# Altium schematic sheet smarttrashcan.SchDoc
size A; SheetNumber: 1; SheetTotal: 1
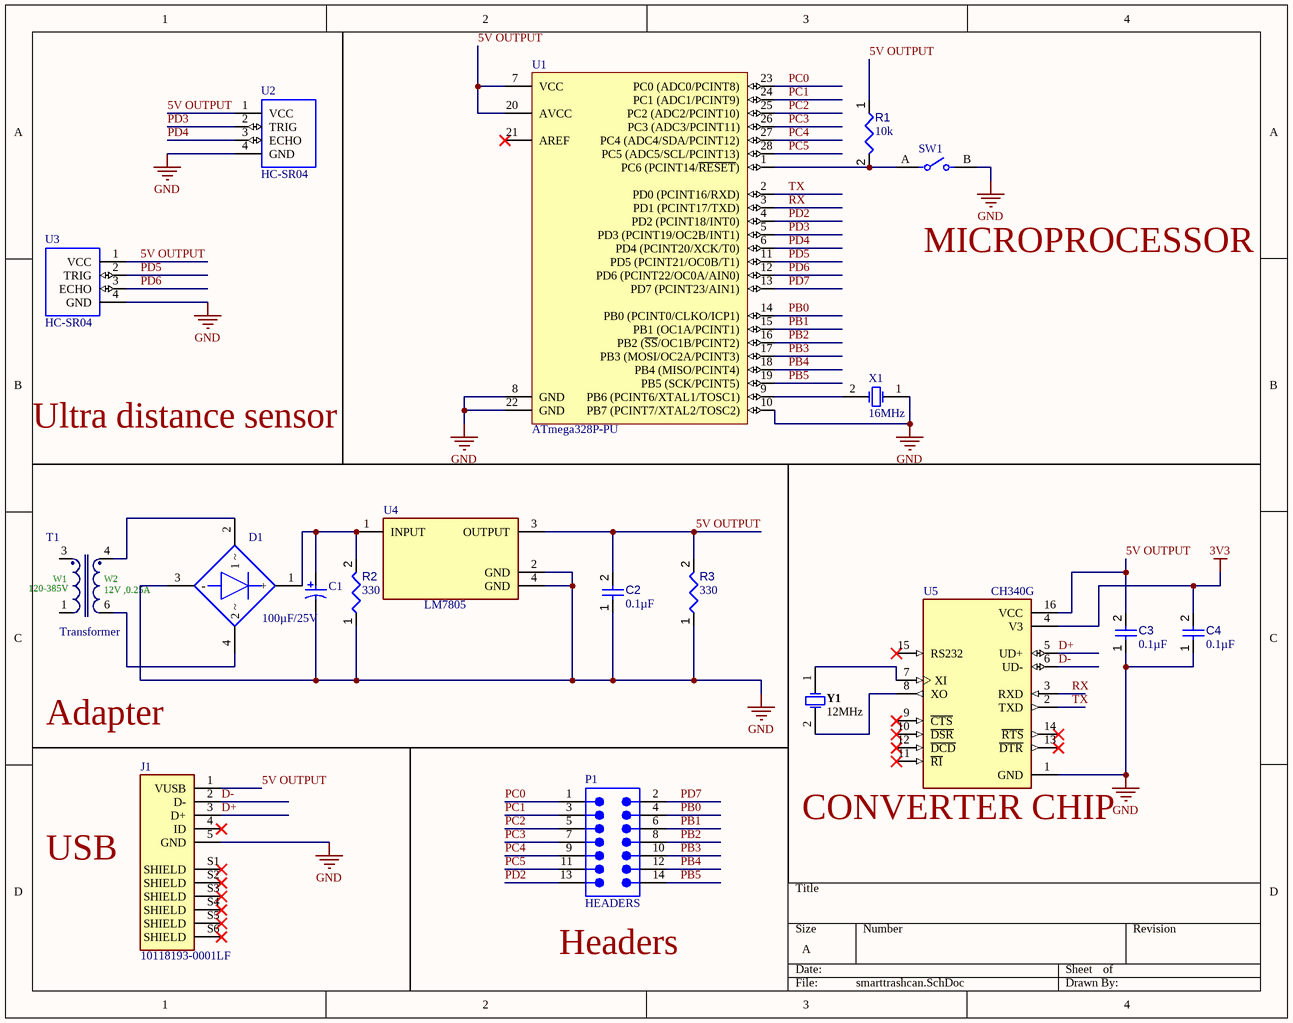
[diagram p0: smarttrashcan.SchDoc]

## Parts
C1  100µF/25V  [PNSC-FK-V-D8_V]
C2  value 0.1µF  [CAPC1005X56X25LL10T15]  (hidden comment: Capacitor 0.1 uF +/- 5% 16 V 0402)
C3  value 0.1µF  [CAPC1005X56X25LL10T15]  (hidden comment: Capacitor 0.1 uF +/- 5% 16 V 0402)
C4  value 0.1µF  [CAPC1005X56X25LL10T15]  (hidden comment: Capacitor 0.1 uF +/- 5% 16 V 0402)
D1  (no value)  [FP-MBF-MFG]
J1  10118193-0001LF  [AMPHENOL_10118193-0001LF]
P1  HEADERS  [610114249121]
R1  value 10k  [RESC0402(1005)_L]  (hidden comment: 10KR2F)
R2  value 330  [RESC0402(1005)_L]  (hidden comment: Resistor 330R +/-5 % 0402 63 mW)
R3  value 330  [RESC0402(1005)_L]  (hidden comment: Resistor 330R +/-5 % 0402 63 mW)
SW1  EVQ11Y04K  [FP-EVQ11Y04K-MFG]  (value not drawn)
T1  Transformer  [EE13_7_4-Vertical_(EF12.6)]
U1  ATmega328P-PU  [28P3]
U2  HC-SR04  [XCVR_HC-SR04]
U3  HC-SR04  [XCVR_HC-SR04]
U4  LM7805  [FP-DCY0004A-MFG]
U5  CH340G  [SOIC127P600X180-16N]
X1  16MHz  [FOX-FOXSDLF160-20_V]
Y1  12MHz  [FOX-FOXSLF-2_V]

## Nets
3V3: C4.2 U5.4(V3)
GND: C1.2 C2.1 C3.1 C4.1 D1.3(-) J1.5(GND) R2.1 R3.1 SW1.B U1.8(GND) U1.10(PB7_(PCINT7/XTAL2/TOSC2)) U1.22(GND) U2.4(GND) U3.4(GND) U4.2(GND) U4.4(GND) U5.1(GND) X1.1(X1)
5V OUTPUT: C2.2 C3.2 J1.1(VUSB) R1.1 R3.2 U1.7(VCC) U1.20(AVCC) U2.1(VCC) U3.1(VCC) U4.3(OUTPUT) U5.16(VCC)
D+: J1.3(D+) U5.5(UD+)
D-: J1.2(D-) U5.6(UD-)
PB0: P1.4 U1.14(PB0_(PCINT0/CLKO/ICP1))
PB1: P1.6 U1.15(PB1_(OC1A/PCINT1))
PB2: P1.8 U1.16(PB2_(~{SS}/OC1B/PCINT2))
PB3: P1.10 U1.17(PB3_(MOSI/OC2A/PCINT3))
PB4: P1.12 U1.18(PB4_(MISO/PCINT4))
PB5: P1.14 U1.19(PB5_(SCK/PCINT5))
PC0: P1.1 U1.23(PC0_(ADC0/PCINT8))
PC1: P1.3 U1.24(PC1_(ADC1/PCINT9))
PC2: P1.5 U1.25(PC2_(ADC2/PCINT10))
PC3: P1.7 U1.26(PC3_(ADC3/PCINT11))
PC4: P1.9 U1.27(PC4_(ADC4/SDA/PCINT12))
PC5: P1.11 U1.28(PC5_(ADC5/SCL/PCINT13))
PD2: P1.13 U1.4(PD2_(PCINT18/INT0))
PD3: U1.5(PD3_(PCINT19/OC2B/INT1)) U2.2(TRIG)
PD4: U1.6(PD4_(PCINT20/XCK/T0)) U2.3(ECHO)
PD5: U1.11(PD5_(PCINT21/OC0B/T1)) U3.2(TRIG)
PD6: U1.12(PD6_(PCINT22/OC0A/AIN0)) U3.3(ECHO)
PD7: P1.2 U1.13(PD7_(PCINT23/AIN1))
RX: U1.3(PD1_(PCINT17/TXD)) U5.3(RXD)
TX: U1.2(PD0_(PCINT16/RXD)) U5.2(TXD)
NetC1_1: C1.1 D1.1(+) R2.2 U4.1(INPUT)
NetD1_2: D1.2(1_~) T1.4
NetD1_4: D1.4(2_~) T1.6
NetR1_2: R1.2 SW1.A U1.1(PC6_(PCINT14/~{RESET}))
NetU1_9: U1.9(PB6_(PCINT6/XTAL1/TOSC1)) X1.2(X2)
NetU5_7: U5.7(XI) Y1.1
NetU5_8: U5.8(XO) Y1.2

Not connected (* = marked no-connect by the designer): J1 4(ID)* S1(SHIELD)* S2(SHIELD)* S3(SHIELD)* S4(SHIELD)* S5(SHIELD)* S6(SHIELD)*; T1 1 3; U1 21(AREF)*; U5 9(~{CTS})* 10(~{DSR})* 11(~{RI})* 12(~{DCD})* 13(~{DTR})* 14(~{RTS})* 15(RS232)*

## Notes on the sheet
- MICROPROCESSOR
- Ultra distance sensor
- Adapter
- (near U5) CONVERTER CHIP
- USB
- (near P1) Headers
- (in symbol CMP-1476-00004-1) W1; W2; 120-385V; 12V ,0.25A

## Library data of the parts
C1 = CMP-2000-06206-1: Aluminum Electrolytic Capacitor, 100 uF, +/- 20%, 25 V, 2-Pin SMD (Size Code D8), -55 to 105 degC, RoHS, Tape and Reel; Manufacturer: Panasonic; Type: Can; Lifetime@Temperature: 2000Hrs@105°C; Capacitance: 100µF; Rated Voltage: 25V; Ripple Current: 280mA; Impedance: 0.34O; Case Size/Dimension: Ø6.3x7.7mm; Operating Temp-Max: 105°C; Series: FK; Package URL: http://industrial.panasonic.com/cdbs/www-data/pdf/RDE0000/DME0000COL48.pdf; Mounting Technology: SurfaceMount; Package Description: 2-Pin Electrolytic Aluminum Capacitor, Body 6.6 x 6.6 mm; Datasheet Version: 03/2016; Datasheet URL: http://industrial.panasonic.com/cdbs/www-data/pdf/RDE0000/ABA0000C1181.pdf; Manufacturer URL: http://www.panasonic.com/; Package Reference: FK-V-D8; Operating Temp Range: -55to+105°C
C2-C4 = CMP-001-00001-6: Chip Capacitor, 0.1 uF, +/- 5%, 16 V, 0402 (1005 Metric); Capacitor Type: Ceramic; Voltage Rating: 16V; Max Operating Temperature: 125°C; Min Operating Temperature: -55°C; Case/Package: 0402; Mounting Technology: SM; Pins: 2; Tolerance: 5%; RoHS Compliant: True
D1 = CMP-12791-000022-1: BRIDGE RECT 1PHASE 1KV 800MA MBF; Manufacturer: Diodes Incorporated; Manufacturer Part Number: MB10F-13; Max Surge Forward Current: 30A; Max Repetitive Reverse Voltage: 1000V; Peak Reverse Current: 0.2uA; Description: Bridge Rectifier Single Phase Standard 1kV Surface Mount MBF; Capacitance: 8pF; Value: 8pF; Max Junction Temp: +150°C; Forward Current: 0.5A; ComponentLink2Description: Datasheet; Category: Diode; RoHS: TRUE; Package: MBF; Device Class L2: Diodes; Lead Free: Yes; Temperature Range Low: -55°C; Footprint Url: https://www.diodes.com/assets/Package-Files/MBF.pdf; Octopart: https://octopart.com/mb10f-13-diodes+inc.-82160020; Automotive: No; Device Class L3: Rectifier Diodes; Digikey Description: BRIDGE RECT 1PHASE 1KV 800MA MBF; ComponentLink2URL: https://www.diodes.com/assets/Datasheets/MB10F.pdf; Reverse Voltage: 1000V; Temperature Range High: +150°C; Temperature: -55°C to +150°C; Mouser Description: Diode Rectifier Bridge Single 1000V 0.8A 4-Pin Case MBF T/R; Height: 1.8mm; Device Class L1: Discrete Semiconductors
J1 = CMP-002-00074-1: Right Angle Surface Mount Mount Female USB Connector 100 V ac 1.8A; MF: Amphenol ICC; Source: 10118193-0001LF.SchLib; Component Type: Standard; SnapEDA_Link: https://www.snapeda.com/parts/10118193-0001LF/Amphenol+FCI/view-part/?ref=snap; MP: 10118193-0001LF; Check_prices: https://www.snapeda.com/parts/10118193-0001LF/Amphenol+FCI/view-part/?ref=eda; Design Item ID: 10118193-0001LF; Value: *; Case/Package: None; Pins: 11
P1 = CMP-1502-01150-3: NexarPartId: 52645097; Row Spacing: 2.54mm; Contact Resistance: 20mΩ; Number of Contacts: 14; Gender: Male; Current Rating: 3A; Operating Supply Voltage: 250V; Connector Type: Male Pin; Contact Mating Length: 5.9944mm; Mount: Surface Mount; Number of Rows: 2; Contact Plating: Gold; Lead Pitch: 2.54mm; Pitch: 2.54mm; REACH SVHC: Unknown; Number of Positions: 14; RoHS: Compliant; Termination: Solder; Number of Pins: 14; Packaging: Tape and Reel; Color: Black
R1 = CMP-009-00066-2: 10K 0.063W 1% 0402 (1005 Metric)  SMD; Power: 63mW; Case/Package: 0402; Mounting Technology: SMT; Pins: 2; Tolerance: 1%
R2 R3 = CMP-009-00132-3: Chip Resistor, 330 Ohms, +/-5 %, 63 mW, -55 to 155 degC, 0402; Power: 63mW; Tolerance: 5%; Pins: 2; Max Operating Temperature: 155°C; Min Operating Temperature: -55°C; Case/Package: 0402
SW1 = CMP-05618-000106-1: SWITCH TACTILE SPST-NO 0.02A 15V; Operating Force: 1.6N; Actuator Type: Standard; Actuator Length: 0.4mm; Actuator Color: Black; Mechanical Life: 1000000Cycles; Switch Function: Off-Mom; Contact Resistance: 50mR; Switch Travel: 0.25mm; Throw Configuration: SPST; Illumination Type: Non-Illuminated; Package Quantity: 1; Max Operating Temperature: 70°C; Case/Package: Radial; Radiation Hardening: No; Packaging: Tape and Reel; Termination: PC Pin; Orientation: Straight; Min Operating Temperature: -20°C; Lead Free: Lead Free; Electrical Life: 1000000Cycles; RoHS Compliant: Yes; Max Voltage Rating (DC): 15V; Mount: Through Hole; Series: EVQ11; Size: 6mm
T1 = CMP-1476-00004-1: Off-Line Transformer WE-UNIT , L=2.8mH; Manufacturer: Wuerth Elektronik; PartNumber: 7491181012; Output Voltage (DC): 12; Turns Ratio: "8.1","1"; Output Current (A): 0.25; Inductance: 2.8mH; Input Voltage (AC): 85-265; ComponentLink2URL: http://www.we-online.de/katalog/media/pdf/7491181012.pdf; ComponentLink1Description: Manufacturer URL; ComponentLink1URL: http://www.we-online.com; ComponentLink2Description: Datasheet; PackageReference: EE13_7_4-Vertical_(EF12.6)
U1 = CMP-0095-00013-2: 8-bit AVR Microcontroller, 32KB Flash, 1KB EEPROM, 2KB SRAM, 28-pin PDIP, Industrial Grade (-40°C to 85°C); RevisionNote: DatasheetVersion updated. URLs added.; PackageVersion: revB, Sep-2001; PackageDescription: 28-lead (0.300"/7.62mm Wide) Plastic Dual Inline Package (PDIP); DatasheetVersion: revD, May-2011; ComponentLink1Description: Manufacturer URL; ComponentLink1URL: http://www.atmel.com/; PackageReference: 28P3; ComponentLink2Description: ATmega48A/48PA/88A/88PA/168A/168PA/328/328P Datasheet; ComponentLink3URL: http://www.atmel.com/dyn/resources/prod_documents/8271S.pdf; ComponentLink2URL: http://www.atmel.com/dyn/resources/prod_documents/8271.pdf; ComponentLink3Description: ATmega48A/48PA/88A/88PA/168A/168PA/328/328P Summary
U2 U3 = CMP-041-000000-1: Ultrasonic Sensor Module; Package: None; Design Item ID: HC-SR04; Value: *; MP: HC-SR04; Pin Count: 4; Availability: Unavailable; Price: None; Source: HC-SR04.SchLib; Component Type: Standard
U4 = CMP-04917-000007-1: IC REG LINEAR 5V 1.5A SOT223-4; Manufacturer Part Number: LM7805MP/NOPB; Manufacturer: Texas Instruments; Max Supply Voltage: 30V; Max Junction Temp: +150°C; Number Of Outputs: 1; Standoff Height: 0.02mm; Dropout Voltage: 2V; Accuracy Percentage: 3%; Nominal Supply Current: 8mA; Output Type: Fixed; Min Supply Voltage: 7.5V; Lead Free: Yes; Device Class L1: Integrated Circuits (ICs); Package: DCY0004A; ComponentLink2Description: Datasheet; Temperature Range Low: 0°C; ComponentLink2URL: http://www.ti.com/lit/ds/symlink/lm7800.pdf; Height: 1.8mm; Temperature: 0°C to +125°C; Category: IC; Device Class L3: Voltage Regulators - Linear; Octopart: https://octopart.com/lm7805mp%2Fnopb-texas+instruments-74629991; Device Class L2: Power Management ICs; Output Voltage: 5V; RoHS: TRUE; Temperature Range High: +125°C; Automotive: No; Digikey Description: IC REG LINEAR 5V 1.5A SOT223-4; Output Current: 1.5A
U5 = CMP-031-000000-1: USB Interface Integrated Circuit; MF: WCH; Source: CH340G.SchLib; Price: None; Check_prices: https://www.snapeda.com/parts/Ch340G/WCH/view-part/?ref=eda; SnapEDA_Link: https://www.snapeda.com/parts/Ch340G/WCH/view-part/?ref=snap; Design Item ID: CH340G; Availability: Not in stock; Package: None; Pin Count: 16; Value: *; MP: Ch340G; Component Type: Standard
X1 = CMP-003-00024-2: Resistance Weld SMD Crystal, 16 MHz, +/- 30 ppm, 20 pF, -20 to 70 degC, 2-Pin SMD, RoHS, Tape and Reel; Manufacturer: FOX Electronics; Load Capacitance: 20pF; Frequency Tolerance: 30ppm; Tolerance: 50ppm; Resistance: 40Ohm; ESR: 40; Packaging: TapeandReel; Mounting Technology: SM; Package Description: 2-Pin Surface Mount Device, Body 5 x 11.7 mm, Height 4.5 mm; Pins: 2; Datasheet URL: http://foxonline.com/pdfs/hc49sdlf.pdf; Max Operating Temperature: 70°C; Package Reference: FOX-FOXSDLF160-20; Datasheet Version: Mar-15; Package Quantity: 1; Manufacturer URL: http://www.foxonline.com/; Case/Package: FOX-FOXSDLF160-20; Frequency: 16MHz; Min Operating Temperature: -20°C; RoHS Compliant: True
Y1 = CMP-003-00026-2: Resistance Weld Thru-Hole Crystal, 12 MHz, +/-30 ppm, 20 pF, -20 to 70 degC, 2-Pin THD, RoHS, Bulk; Manufacturer: FOX Electronics; ESR: 60; Resistance: 60Ohm; Frequency Tolerance: 30ppm; Load Capacitance: 20pF; Tolerance: 50ppm; Max Operating Temperature: 70°C; Case/Package: FOXSLF-2; Datasheet Version: Mar-15; Mounting Technology: TH; Package Quantity: 100; Package Description: 2-Pin Through Hole Device, Body 11.35 x 4.65 mm, Pitch 4.88 mm; Packaging: Bulk; Package Reference: FOXSLF-2; RoHS Compliant: True; Pins: 2; Frequency: 12MHz; Datasheet URL: http://www.foxonline.com/pdfs/hc49slf.pdf; Manufacturer URL: http://www.foxonline.com/; Min Operating Temperature: -20°C